# Altium schematic sheet STM32G473RET6_PINOUT.SchDoc
size C; SheetNumber: 17; SheetTotal: 23
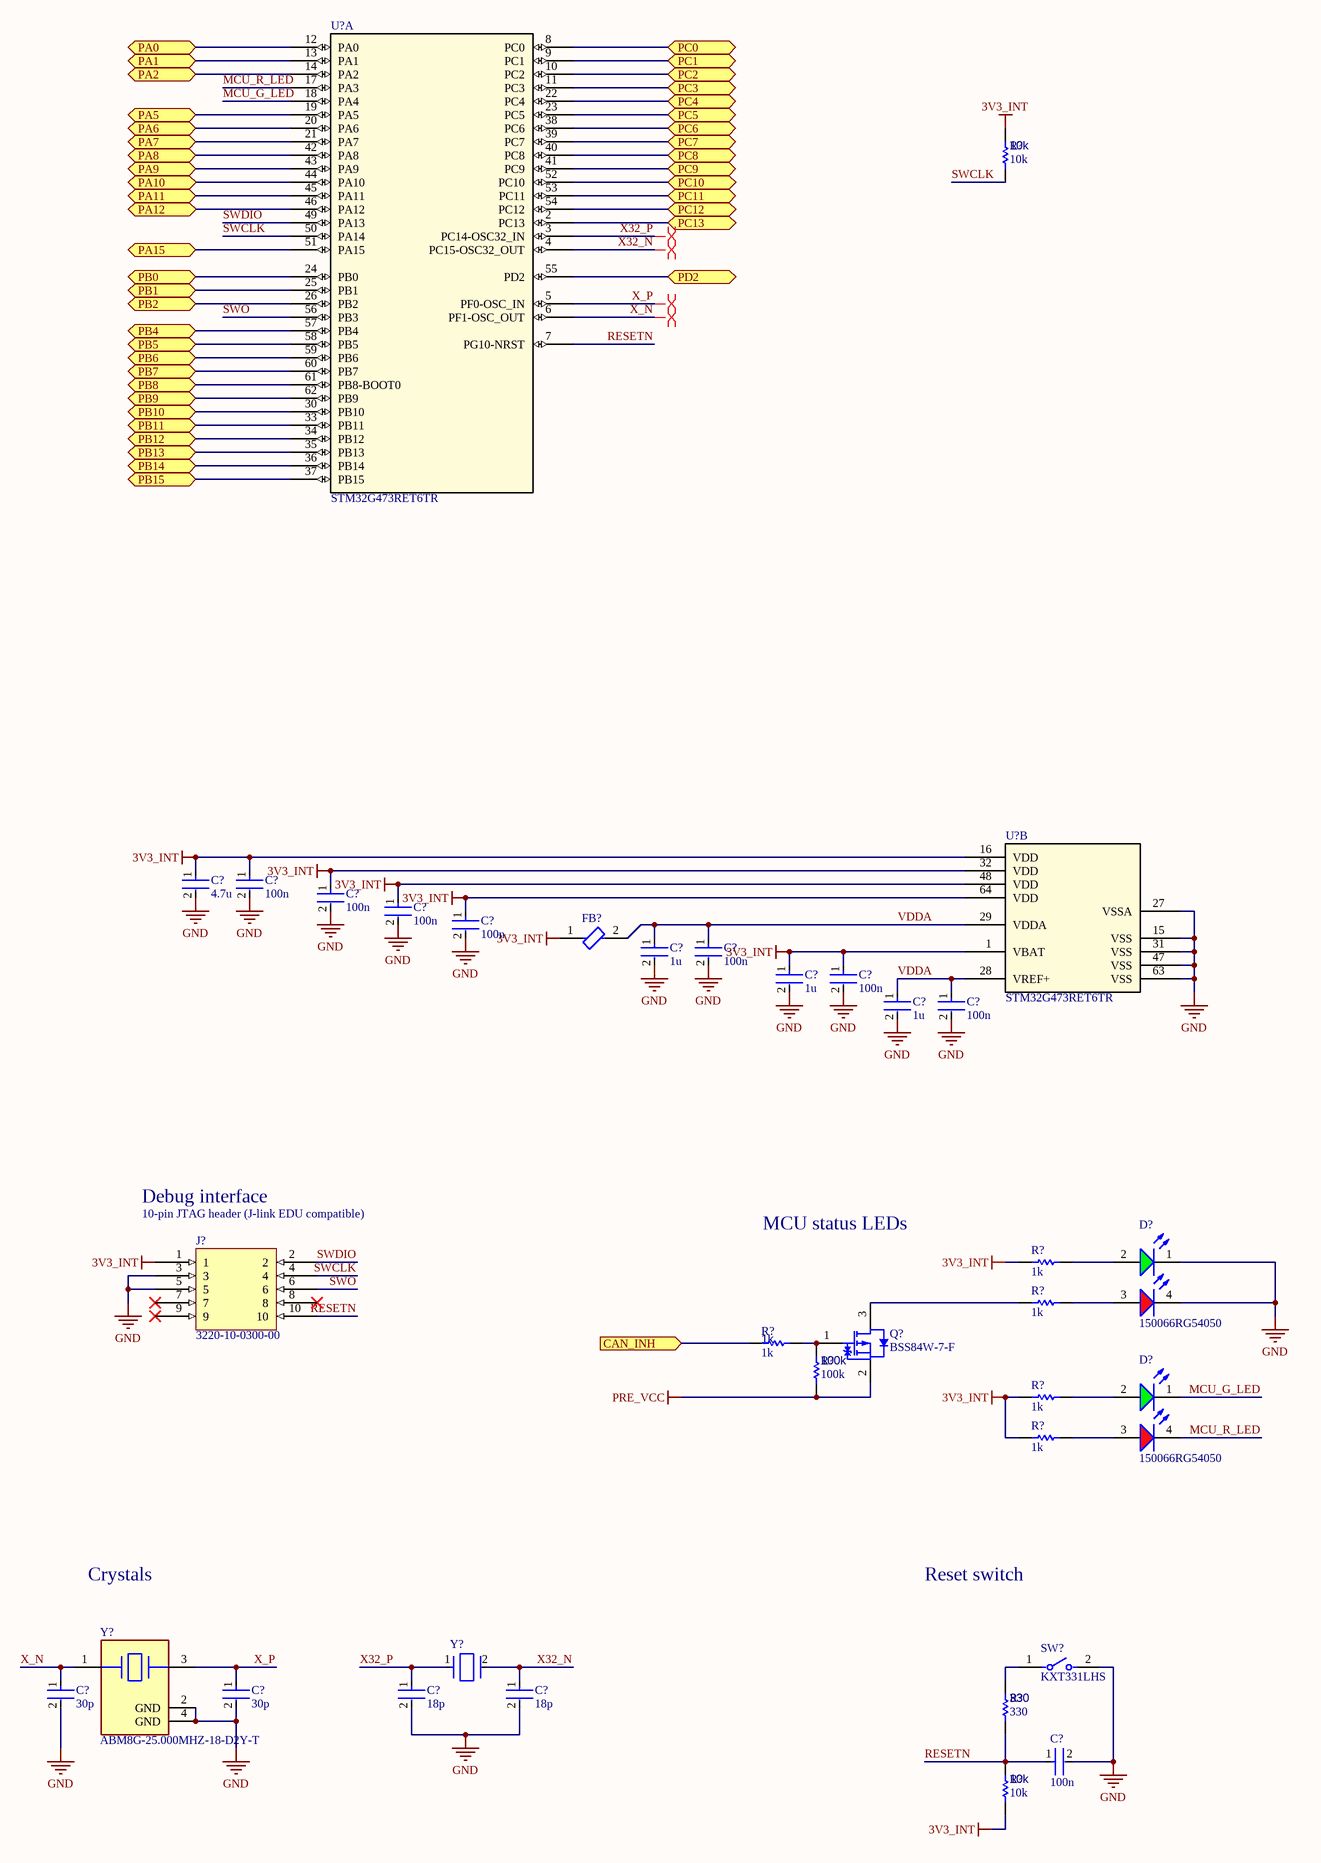
[diagram p0: STM32G473RET6_PINOUT.SchDoc]

## Parts
(Parts that share a designator on the sheet are numbered #1, #2 ... from top to bottom, then left to right.)
C?#1  4.7u  [FP-0402-L_1_0_0_05-W_0_5-IPC_A]
C?#2  100n  [FP-0402-L_1_0_0_05-W_0_5-IPC_A]
C?#3  100n  [FP-0402-L_1_0_0_05-W_0_5-IPC_A]
C?#4  100n  [FP-0402-L_1_0_0_05-W_0_5-IPC_A]
C?#5  100n  [FP-0402-L_1_0_0_05-W_0_5-IPC_A]
C?#6  1u  [FP-0402-L_1_0_0_05-W_0_5-IPC_A]
C?#7  100n  [FP-0402-L_1_0_0_05-W_0_5-IPC_A]
C?#8  1u  [FP-0402-L_1_0_0_05-W_0_5-IPC_A]
C?#9  100n  [FP-0402-L_1_0_0_05-W_0_5-IPC_A]
C?#10  1u  [FP-0402-L_1_0_0_05-W_0_5-IPC_A]
C?#11  100n  [FP-0402-L_1_0_0_05-W_0_5-IPC_A]
C?#12  30p  [FP-0402-L_1_0_0_05-W_0_5-IPC_A]
C?#13  30p  [FP-0402-L_1_0_0_05-W_0_5-IPC_A]
C?#14  18p  [FP-0402-L_1_0_0_05-W_0_5-IPC_A]
C?#15  18p  [FP-0402-L_1_0_0_05-W_0_5-IPC_A]
C?#16  100n  [FP-0402-L_1_0_0_05-W_0_5-IPC_A]
D?#1  150066RG54050  [WL-SBCD_0606]
D?#2  150066RG54050  [WL-SBCD_0606]
FB?  BLM15PX601SN1D  [FP-BLM15-0_05-MFG]  (value not drawn)
J?  3220-10-0300-00  [3220-10-0300-00-Footprint-1]
Q?  BSS84W-7-F  [DIOD-SOT323-3_V]
R?#1  10k  [R0603B]
R?#2  1k  [R0603B]
R?#3  1k  [R0603B]
R?#4  1k  [R0603B]
R?#5  100k  [R0603B]
R?#6  1k  [R0603B]
R?#7  1k  [R0603B]
R?#8  330  [R0603B]
R?#9  10k  [R0603B]
SW?  KXT331LHS  [FP-KXT331LHS-MFG]
U?#1  STM32G473RET6TR  [STM32G473RET6TR-Footprint-1]  (part A of 2)
U?#2  STM32G473RET6TR  [STM32G473RET6TR-Footprint-1]  (part B of 2)
Y?#1  ABM8G-25.000MHZ-18-D2Y-T  [FP-ABM8G-MFG]
Y?#2  ECS-.327-12.5-1210-TR  [FP-ECX-1210-MFG]  (value not drawn)

## Ports
CAN_INH (in), PA0 (bidir), PA1 (bidir), PA2 (bidir), PA5 (bidir), PA6 (bidir), PA7 (bidir), PA8 (bidir), PA9 (bidir), PA10 (bidir), PA11 (bidir), PA12 (bidir), PA15 (bidir), PB0 (bidir), PB1 (bidir), PB2 (bidir), PB4 (bidir), PB5 (bidir), PB6 (bidir), PB7 (bidir), PB8 (bidir), PB9 (bidir), PB10 (bidir), PB11 (bidir), PB12 (bidir), PB13 (bidir), PB14 (bidir), PB15 (bidir), PC0 (bidir), PC1 (bidir), PC2 (bidir), PC3 (bidir), PC4 (bidir), PC5 (bidir), PC6 (bidir), PC7 (bidir), PC8 (bidir), PC9 (bidir), PC10 (bidir), PC11 (bidir), PC12 (bidir), PC13 (bidir), PD2 (bidir)

## Nets
3V3_INT: C?#1.1 C?#2.1 C?#3.1 C?#4.1 C?#5.1 C?#8.1 C?#9.1 FB?.1 J?.1 R?#1.2 R?#2.2 R?#6.2 R?#7.2 R?#9.1 U?#2.1(VBAT) U?#2.16(VDD) U?#2.32(VDD) U?#2.48(VDD) U?#2.64(VDD)
GND: C?#1.2 C?#2.2 C?#3.2 C?#4.2 C?#5.2 C?#6.2 C?#7.2 C?#8.2 C?#9.2 C?#10.2 C?#11.2 C?#12.2 C?#13.2 C?#14.2 C?#15.2 C?#16.2 D?#1.1(K) D?#1.4(K) J?.3 J?.5 SW?.2 U?#2.15(VSS) U?#2.27(VSSA) U?#2.31(VSS) U?#2.47(VSS) U?#2.63(VSS) Y?#1.2(GND) Y?#1.4(GND)
PRE_VCC: Q?.2(S) R?#5.2
CAN_INH: R?#4.2 ; port CAN_INH
MCU_G_LED: D?#2.1(K) U?#1.18(PA4)
MCU_R_LED: D?#2.4(K) U?#1.17(PA3)
PA0: U?#1.12(PA0) ; port PA0
PA1: U?#1.13(PA1) ; port PA1
PA2: U?#1.14(PA2) ; port PA2
PA5: U?#1.19(PA5) ; port PA5
PA6: U?#1.20(PA6) ; port PA6
PA7: U?#1.21(PA7) ; port PA7
PA8: U?#1.42(PA8) ; port PA8
PA9: U?#1.43(PA9) ; port PA9
PA10: U?#1.44(PA10) ; port PA10
PA11: U?#1.45(PA11) ; port PA11
PA12: U?#1.46(PA12) ; port PA12
PA15: U?#1.51(PA15) ; port PA15
PB0: U?#1.24(PB0) ; port PB0
PB1: U?#1.25(PB1) ; port PB1
PB2: U?#1.26(PB2) ; port PB2
PB4: U?#1.57(PB4) ; port PB4
PB5: U?#1.58(PB5) ; port PB5
PB6: U?#1.59(PB6) ; port PB6
PB7: U?#1.60(PB7) ; port PB7
PB8: U?#1.61(PB8-BOOT0) ; port PB8
PB9: U?#1.62(PB9) ; port PB9
PB10: U?#1.30(PB10) ; port PB10
PB11: U?#1.33(PB11) ; port PB11
PB12: U?#1.34(PB12) ; port PB12
PB13: U?#1.35(PB13) ; port PB13
PB14: U?#1.36(PB14) ; port PB14
PB15: U?#1.37(PB15) ; port PB15
PC0: U?#1.8(PC0) ; port PC0
PC1: U?#1.9(PC1) ; port PC1
PC2: U?#1.10(PC2) ; port PC2
PC3: U?#1.11(PC3) ; port PC3
PC4: U?#1.22(PC4) ; port PC4
PC5: U?#1.23(PC5) ; port PC5
PC6: U?#1.38(PC6) ; port PC6
PC7: U?#1.39(PC7) ; port PC7
PC8: U?#1.40(PC8) ; port PC8
PC9: U?#1.41(PC9) ; port PC9
PC10: U?#1.52(PC10) ; port PC10
PC11: U?#1.53(PC11) ; port PC11
PC12: U?#1.54(PC12) ; port PC12
PC13: U?#1.2(PC13) ; port PC13
PD2: U?#1.55(PD2) ; port PD2
RESETN: C?#16.1 J?.10 R?#8.1 R?#9.2 U?#1.7(PG10-NRST)
SWCLK: J?.4 R?#1.1 U?#1.50(PA14)
SWDIO: J?.2 U?#1.49(PA13)
SWO: J?.6 U?#1.56(PB3)
VDDA: C?#6.1 C?#7.1 C?#10.1 C?#11.1 FB?.2 U?#2.28(VREF+) U?#2.29(VDDA)
X32_N: C?#15.1 U?#1.4(PC15-OSC32_OUT) Y?#2.2(Out/In)
X32_P: C?#14.1 U?#1.3(PC14-OSC32_IN) Y?#2.1(In/Out)
X_N: C?#12.1 U?#1.6(PF1-OSC_OUT) Y?#1.1
X_P: C?#13.1 U?#1.5(PF0-OSC_IN) Y?#1.3
NetD?#1_2: D?#1.2(A) R?#2.1
NetD?#1_3: D?#1.3(A) R?#3.1
NetD?#2_2: D?#2.2(A) R?#6.1
NetD?#2_3: D?#2.3(A) R?#7.1
NetQ?_1: Q?.1(G) R?#4.1 R?#5.1
NetQ?_3: Q?.3(D) R?#3.2
NetR?#8_2: R?#8.2 SW?.1

Not connected (* = marked no-connect by the designer): J? 7* 8* 9*

## Layout directives
differential pair: X32_N, X32_P, X_N, X_P

## Notes on the sheet
- Debug interface
- (near J?) 10-pin JTAG header (J-link EDU compatible)
- MCU status LEDs
- Crystals
- Reset switch

## Library data of the parts
C?#1-C?#16 = CMP-001-00058-1: LARGE PADS, 0402 CAP, CHANGE COMMENT TO MATCH REAL P/N; Capacitor Type: Ceramic; Min Operating Temperature: -55°C; Mounting Technology: Surface Mount; Pins: 2; Case/Package: 0402; RoHS Compliant: Yes; Max Operating Temperature: 85°C
  C?#1: Value: 4.7u
  C?#2-C?#5 C?#7 C?#9 C?#11 C?#16: Value: 100n
  C?#6 C?#8 C?#10: Value: 1u
  C?#12 C?#13: Value: 30p
  C?#14 C?#15: Value: 18p
D?#1 D?#2 = CMP-004-00040-2: Led, Red/Grn, 180Mcd/230Mcd, 624Nm/525Nm Rohs Compliant: Yes; Source: rgled.SchLib; Component Type: Standard; Design Item ID: CMP-004-00034-2; Pins: 4
FB? = CMP-0686-00252-4: Chip Ferrite Bead, 0402, 600Ω @ 100MHz, 0.23Ω, 25%, 900mA; Number of Circuits: 1; Impedance: 600R; DC Resistance (DCR): 230mR; Material: Steel; Length: 1mm; Package Quantity: 10000; Height: 0.5mm; Width: 0.5mm; Max DC Current: 900mA; Number of Lines: 1; Termination: SMD/SMT; Packaging: Tape and Reel; Lead Free: Lead Free; Min Operating Temperature: -55°C; Max Operating Temperature: 125°C; Max Current Rating: 900mA; Case Code (Imperial): 0402; Number of Pins: 2; Current Rating: 900mA; Test Frequency: 100MHz; Case/Package: 0402; Tolerance: 25%; Case Code (Metric): 1005
J? = CMP-001-0013-3: CONN HEADER SMD 10POS 1.27MM
Q? = CMP-2000-06170-1: DIFF P/N!!! / P-Channel Enhancement Mode MOSFET, 310 mW, 20 V, -55 to 150 degC, 3-Pin SOT-323, RoHS, Tape and Reel; Manufacturer: Diodes Inc; Qg Gate Charge: 0.622nC; Drain-Source On Resistance-Max: 750mO; Rated Power Dissipation: 310mW; Drain-to-Source Voltage [Vdss]: 20V; Package Reference: SOT323; Datasheet Version: Rev. 3-2, 09/2013; Package Description: 3-Pin Small Outline Transistor, Body 2 x 1.25 mm, Pitch 0.65 mm; Mounting Technology: SurfaceMount; Manufacturer URL: http://www.diodes.com/; Datasheet URL: http://www.diodes.com/_files/datasheets/ds31861.pdf; Channel Type: P-Channel
R?#1-R?#9 = CMP-009-00002-14: Resistor
  R?#1 R?#9: Value: 10k
  R?#2-R?#4 R?#6 R?#7: Value: 1k
  R?#5: Value: 100k
  R?#8: Value: 330
SW? = CMP-10040-000029-1: SWITCH TACTILE SPST-NO 0.02A 15V; Operating Force: 240gf; Switch Travel: 0.13mm; Illumination Type: Non-Illuminated; Throw Configuration: SPST; Number of Ports: 1; Current Rating: 5A; Mechanical Life: 500000Cycles; Switch Function: Off-Mom; Connector Type: USB; Actuator Type: Standard; Gender: Receptacle; Number of Contacts: 24; Contact Plating: Gold; Insulation Color: Black; Min Operating Temperature: -40°C; Packaging: Tape and Reel; Flammability Rating: UL94 V-0; Max Operating Temperature: 85°C; Termination: Solder; Mount: Surface Mount
U?#1 U?#2 = CMP-020-00020-2: MCU 32-Bit STM32 ARM Cortex-M4 RISC 512KB Flash 1.71V to 3.6V 64-Pin LQFP T/R; RoHS Compliant: Yes
Y?#1 = CMP-2000-05733-3: Crystal 25MHz ±20ppm (Tol) ±30ppm (Stability) 18pF FUND 60Ω 4-Pin SMD T/R; Series Resistance: 60R; Length: 3.2mm; Depth: 2.5mm; Packaging: Tape and Reel; Min Operating Temperature: -40°C; Operating Frequency: 25 MHz; Lead Free: Lead Free; Number of Pins: 4; Frequency Tolerance: 20ppm; Radiation Hardening: No; Max Operating Temperature: 85°C; Termination: SMD/SMT; Frequency Stability: 30ppm; Frequency: 25MHz; Series: ABM8G; Mount: Surface Mount; Package Quantity: 1000; Height: 0.039inch; Width: 0.098inch; Case/Package: CSMD; ESR (Equivalent Series Resistance): 60R; Load Capacitance: 18pF; Tolerance: 20ppm
Y?#2 = CMP-40224-000006-1: CRYSTAL 32.7680KHZ 12.5PF SMD; Manufacturer: ECS International; Frequency: 32.768kHz; Esr: 90kΩ; Tolerance: 20ppm; Device Class L1: Passive Components; Load Capacitance: 12.5pF; Temperature: -40°C to +85°C; ComponentLink2URL: https://ecsxtal.com/store/pdf/ECX-1210.pdf; Series: ECX-1210; Octopart: https://octopart.com/ecs-.327-12.5-1210-tr-ecs+international-81221340; ComponentLink2Description: Datasheet; Temperature Range Low: -40°C; Digikey Description: CRYSTAL 32.7680KHZ 12.5PF SMD; Lead Free: Yes; RoHS: TRUE; Device Class L3: Crystals; Automotive: No; Category: Crys; Height: 0.5mm; Manufacturer Part Number: ECS-.327-12.5-1210-TR; Temperature Range High: +85°C; Device Class L2: Crystals / Oscillators; Package: ECX-1210